# EasyEDA Pro project KeysDock65.eprj, schematic keyboard

## Sheets
1 keys: Board Name: keyboard; Create Date: 2025-10-11; Page Name: keys; Project Name: KeysDock65; Schematic Name: keyboard; Update Date: 2025-10-16; Company: 嘉立创EDA; Page Size: A4; Version: V1.0
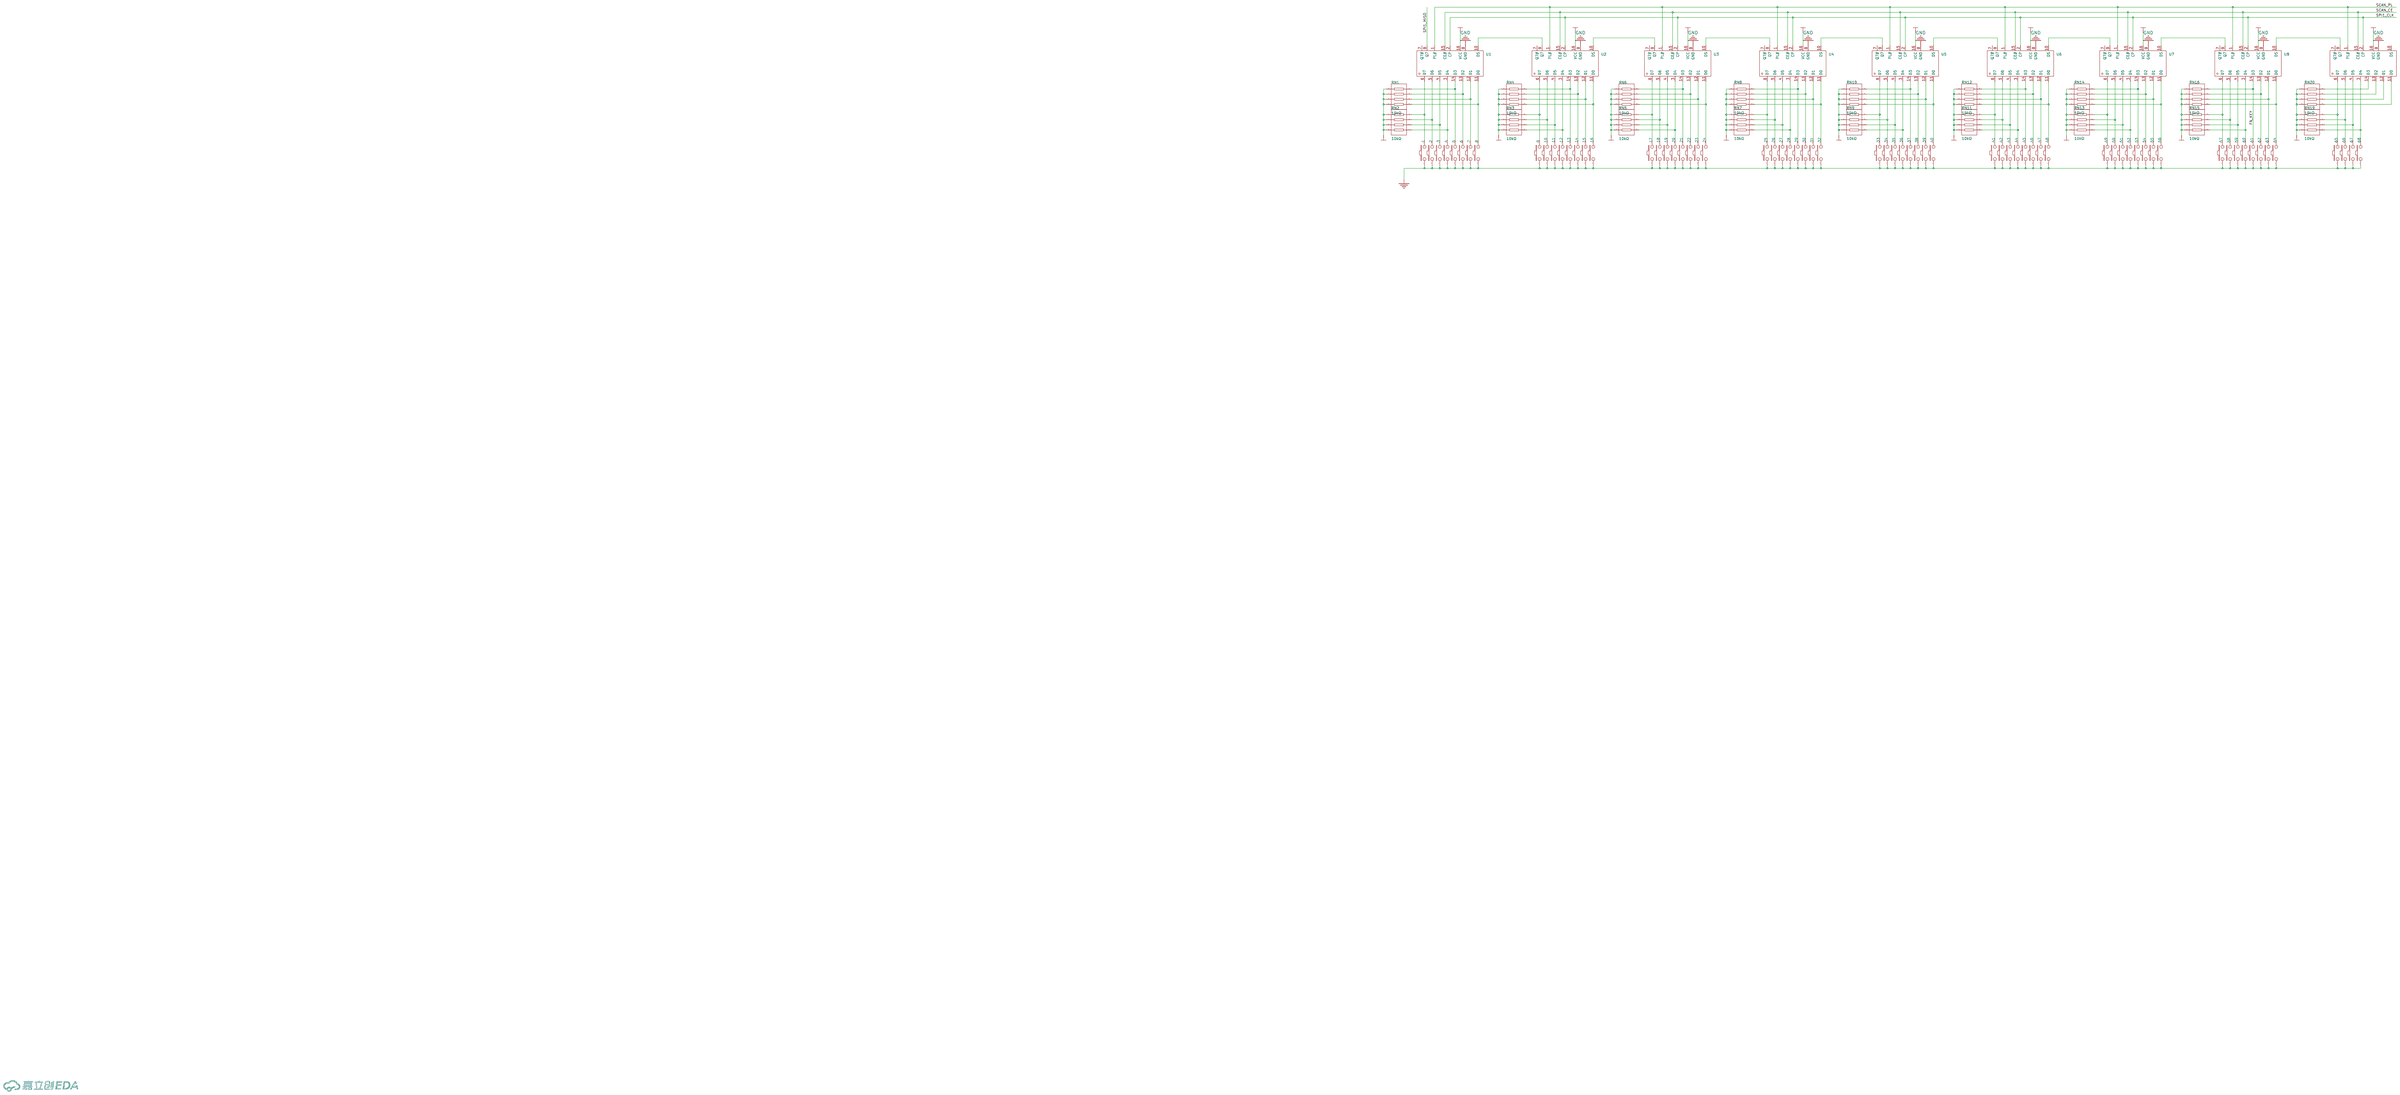
[diagram p0: keys]
2 mcu: Page Name: mcu
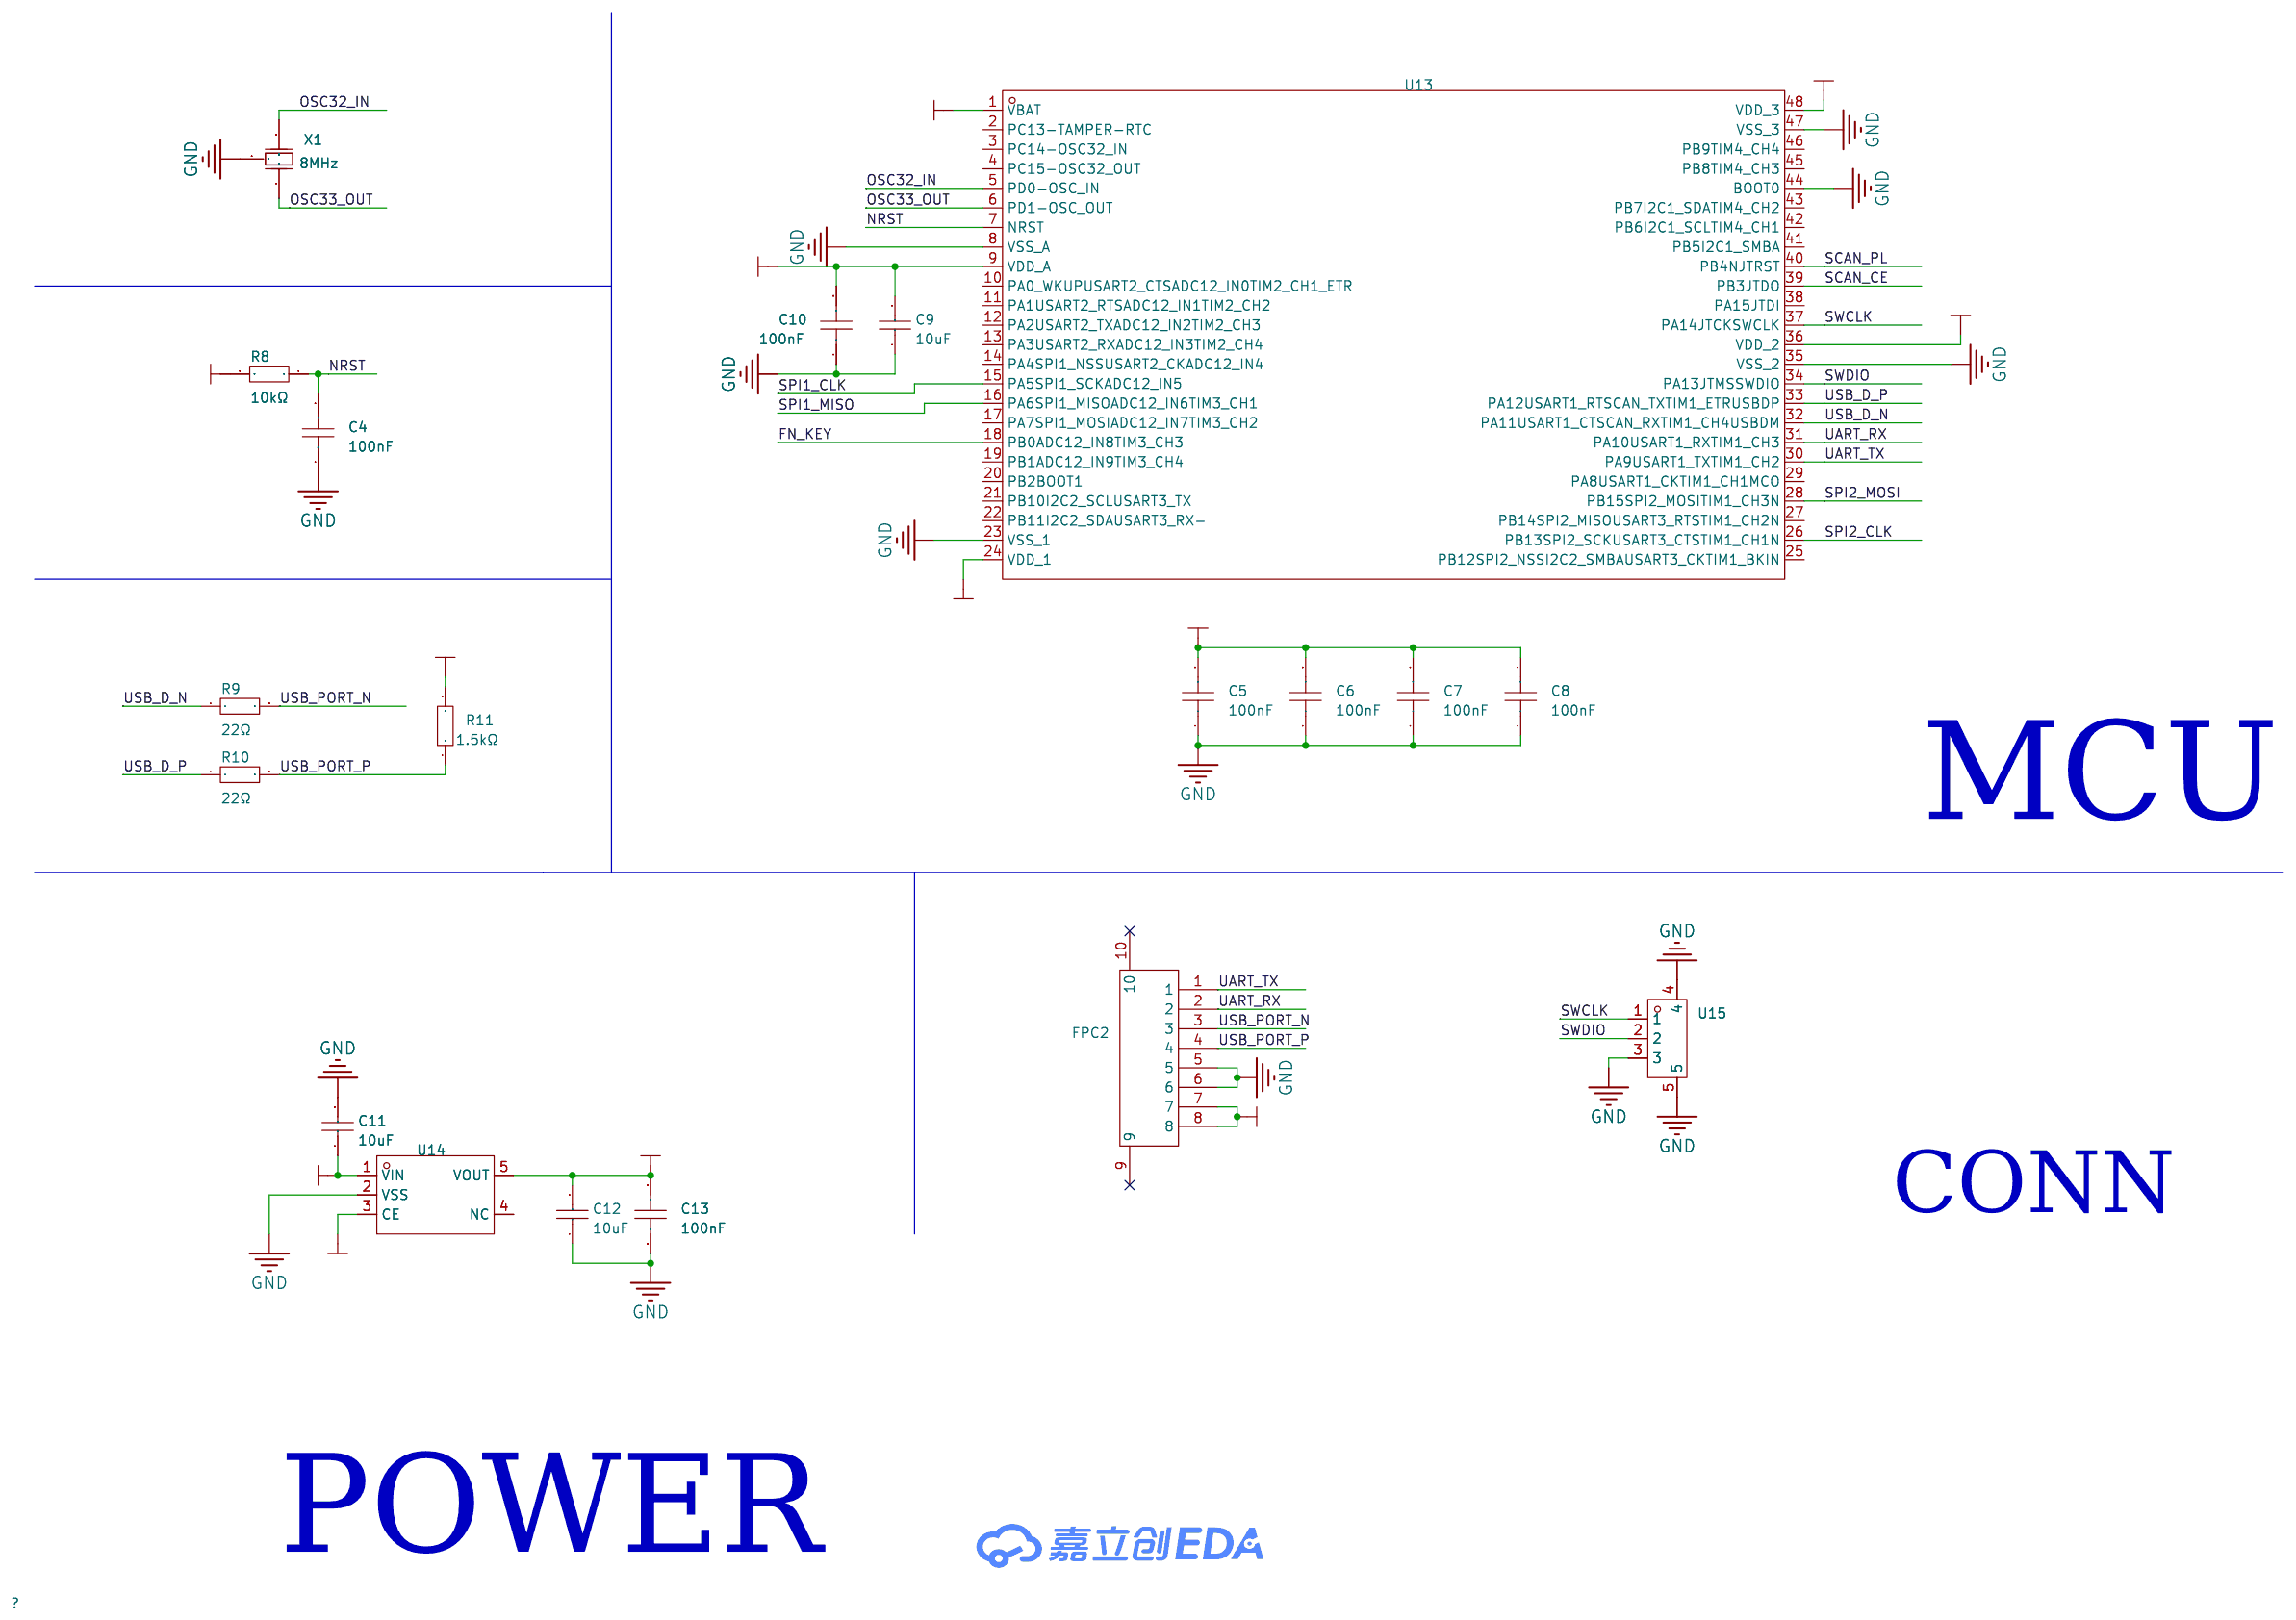
[diagram p1: mcu]
3 led: Page Name: led
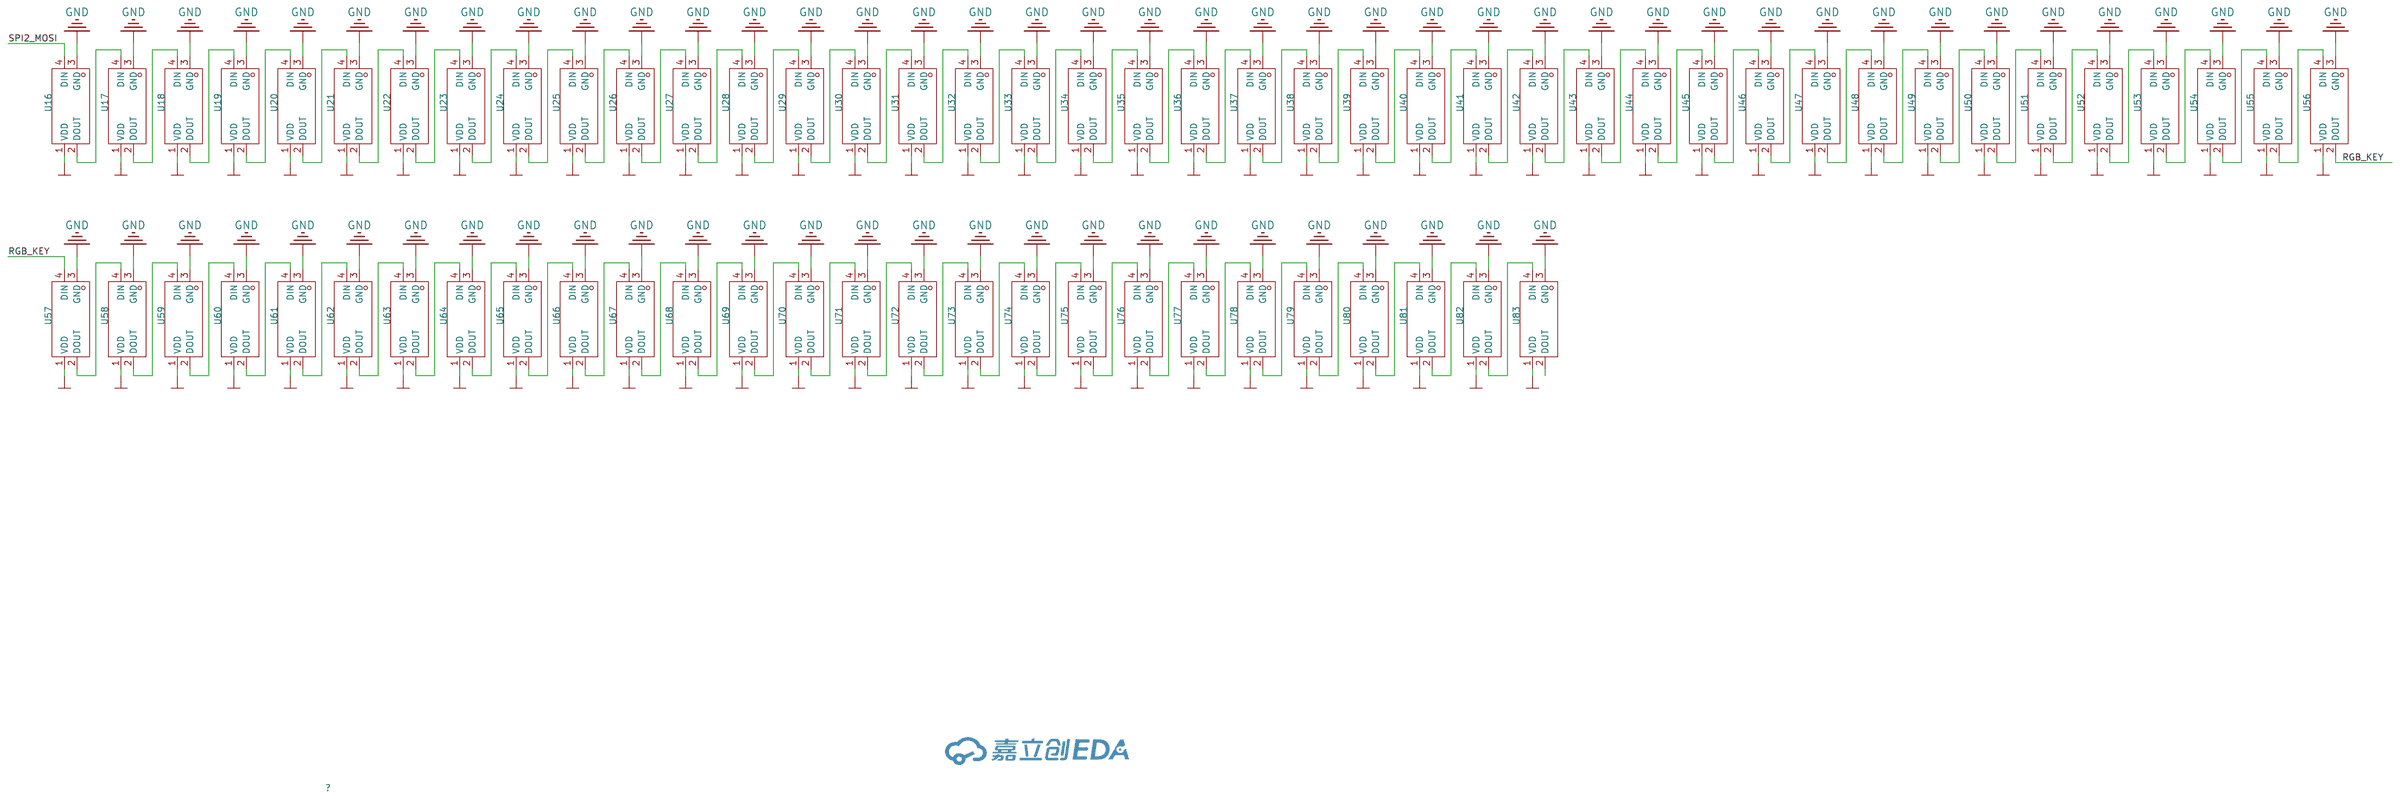
[diagram p2: led]

## Parts
sheet keys
1  -  [轴座_焊接热插拔_不带灯]
2  -  [轴座_焊接热插拔_不带灯]
3  -  [轴座_焊接热插拔_不带灯]
4  -  [轴座_焊接热插拔_不带灯]
5  -  [轴座_焊接热插拔_不带灯]
6  -  [轴座_焊接热插拔_不带灯]
7  -  [轴座_焊接热插拔_不带灯]
8  -  [轴座_焊接热插拔_不带灯]
9  -  [轴座_焊接热插拔_不带灯]
10  -  [轴座_焊接热插拔_不带灯]
11  -  [轴座_焊接热插拔_不带灯]
12  -  [轴座_焊接热插拔_不带灯]
13  -  [轴座_焊接热插拔_不带灯]
14  -  [轴座_焊接热插拔_不带灯]
15  -  [轴座_焊接热插拔_不带灯]
16  -  [轴座_焊接热插拔_不带灯]
17  -  [轴座_焊接热插拔_不带灯]
18  -  [轴座_焊接热插拔_不带灯]
19  -  [轴座_焊接热插拔_不带灯]
20  -  [轴座_焊接热插拔_不带灯]
21  -  [轴座_焊接热插拔_不带灯]
22  -  [轴座_焊接热插拔_不带灯]
23  -  [轴座_焊接热插拔_不带灯]
24  -  [轴座_焊接热插拔_不带灯]
25  -  [轴座_焊接热插拔_不带灯]
26  -  [轴座_焊接热插拔_不带灯]
27  -  [轴座_焊接热插拔_不带灯]
28  -  [轴座_焊接热插拔_不带灯]
29  -  [轴座_焊接热插拔_不带灯]
30  -  [轴座_焊接热插拔_不带灯]
31  -  [轴座_焊接热插拔_不带灯]
32  -  [轴座_焊接热插拔_不带灯]
33  -  [轴座_焊接热插拔_不带灯]
34  -  [轴座_焊接热插拔_不带灯]
35  -  [轴座_焊接热插拔_不带灯]
36  -  [轴座_焊接热插拔_不带灯]
37  -  [轴座_焊接热插拔_不带灯]
38  -  [轴座_焊接热插拔_不带灯]
39  -  [轴座_焊接热插拔_不带灯]
40  -  [轴座_焊接热插拔_不带灯]
41  -  [轴座_焊接热插拔_不带灯]
42  -  [轴座_焊接热插拔_不带灯]
43  -  [轴座_焊接热插拔_不带灯]
44  -  [轴座_焊接热插拔_不带灯]
45  -  [轴座_焊接热插拔_不带灯]
46  -  [轴座_焊接热插拔_不带灯]
47  -  [轴座_焊接热插拔_不带灯]
48  -  [轴座_焊接热插拔_不带灯]
49  -  [轴座_焊接热插拔_不带灯]
50  -  [轴座_焊接热插拔_不带灯]
51  -  [轴座_焊接热插拔_不带灯]
52  -  [轴座_焊接热插拔_不带灯]
53  -  [轴座_焊接热插拔_不带灯]
54  -  [轴座_焊接热插拔_不带灯]
55  -  [轴座_焊接热插拔_不带灯]
56  -  [轴座_焊接热插拔_不带灯]
57  -  [轴座_焊接热插拔_不带灯]
58  -  [轴座_焊接热插拔_不带灯]
59  -  [轴座_焊接热插拔_不带灯]
60  -  [轴座_焊接热插拔_不带灯]
61  -  [轴座_焊接热插拔_不带灯]
62  -  [轴座_焊接热插拔_不带灯]
63  -  [轴座_焊接热插拔_不带灯]
64  -  [轴座_焊接热插拔_不带灯]
65  -  [轴座_焊接热插拔_不带灯]
66  -  [轴座_焊接热插拔_不带灯]
67  -  [轴座_焊接热插拔_不带灯]
68  -  [轴座_焊接热插拔_不带灯]
RN1  10kΩ  [RES-ARRAY-SMD_0603-8P-L3.2-W1.6-BL]
RN2  10kΩ  [RES-ARRAY-SMD_0603-8P-L3.2-W1.6-BL]
RN3  10kΩ  [RES-ARRAY-SMD_0603-8P-L3.2-W1.6-BL]
RN4  10kΩ  [RES-ARRAY-SMD_0603-8P-L3.2-W1.6-BL]
RN5  10kΩ  [RES-ARRAY-SMD_0603-8P-L3.2-W1.6-BL]
RN6  10kΩ  [RES-ARRAY-SMD_0603-8P-L3.2-W1.6-BL]
RN7  10kΩ  [RES-ARRAY-SMD_0603-8P-L3.2-W1.6-BL]
RN8  10kΩ  [RES-ARRAY-SMD_0603-8P-L3.2-W1.6-BL]
RN9  10kΩ  [RES-ARRAY-SMD_0603-8P-L3.2-W1.6-BL]
RN10  10kΩ  [RES-ARRAY-SMD_0603-8P-L3.2-W1.6-BL]
RN11  10kΩ  [RES-ARRAY-SMD_0603-8P-L3.2-W1.6-BL]
RN12  10kΩ  [RES-ARRAY-SMD_0603-8P-L3.2-W1.6-BL]
RN13  10kΩ  [RES-ARRAY-SMD_0603-8P-L3.2-W1.6-BL]
RN14  10kΩ  [RES-ARRAY-SMD_0603-8P-L3.2-W1.6-BL]
RN15  10kΩ  [RES-ARRAY-SMD_0603-8P-L3.2-W1.6-BL]
RN16  10kΩ  [RES-ARRAY-SMD_0603-8P-L3.2-W1.6-BL]
RN19  10kΩ  [RES-ARRAY-SMD_0603-8P-L3.2-W1.6-BL]
RN20  10kΩ  [RES-ARRAY-SMD_0603-8P-L3.2-W1.6-BL]
U1  -  [SOIC-16_L9.9-W3.9-P1.27-LS6.0-BL]
U2  -  [SOIC-16_L9.9-W3.9-P1.27-LS6.0-BL]
U3  -  [SOIC-16_L9.9-W3.9-P1.27-LS6.0-BL]
U4  -  [SOIC-16_L9.9-W3.9-P1.27-LS6.0-BL]
U5  -  [SOIC-16_L9.9-W3.9-P1.27-LS6.0-BL]
U6  -  [SOIC-16_L9.9-W3.9-P1.27-LS6.0-BL]
U7  -  [SOIC-16_L9.9-W3.9-P1.27-LS6.0-BL]
U8  -  [SOIC-16_L9.9-W3.9-P1.27-LS6.0-BL]
U10  -  [SOIC-16_L9.9-W3.9-P1.27-LS6.0-BL]
sheet led
U16  XL-2020RGBC-2812B  [LED-SMD_4P-L2.0-W2.0-BR-1]
U17  XL-2020RGBC-2812B  [LED-SMD_4P-L2.0-W2.0-BR-1]
U18  XL-2020RGBC-2812B  [LED-SMD_4P-L2.0-W2.0-BR-1]
U19  XL-2020RGBC-2812B  [LED-SMD_4P-L2.0-W2.0-BR-1]
U20  XL-2020RGBC-2812B  [LED-SMD_4P-L2.0-W2.0-BR-1]
U21  XL-2020RGBC-2812B  [LED-SMD_4P-L2.0-W2.0-BR-1]
U22  XL-2020RGBC-2812B  [LED-SMD_4P-L2.0-W2.0-BR-1]
U23  XL-2020RGBC-2812B  [LED-SMD_4P-L2.0-W2.0-BR-1]
U24  XL-2020RGBC-2812B  [LED-SMD_4P-L2.0-W2.0-BR-1]
U25  XL-2020RGBC-2812B  [LED-SMD_4P-L2.0-W2.0-BR-1]
U26  XL-2020RGBC-2812B  [LED-SMD_4P-L2.0-W2.0-BR-1]
U27  XL-2020RGBC-2812B  [LED-SMD_4P-L2.0-W2.0-BR-1]
U28  XL-2020RGBC-2812B  [LED-SMD_4P-L2.0-W2.0-BR-1]
U29  XL-2020RGBC-2812B  [LED-SMD_4P-L2.0-W2.0-BR-1]
U30  XL-2020RGBC-2812B  [LED-SMD_4P-L2.0-W2.0-BR-1]
U31  XL-2020RGBC-2812B  [LED-SMD_4P-L2.0-W2.0-BR-1]
U32  XL-2020RGBC-2812B  [LED-SMD_4P-L2.0-W2.0-BR-1]
U33  XL-2020RGBC-2812B  [LED-SMD_4P-L2.0-W2.0-BR-1]
U34  XL-2020RGBC-2812B  [LED-SMD_4P-L2.0-W2.0-BR-1]
U35  XL-2020RGBC-2812B  [LED-SMD_4P-L2.0-W2.0-BR-1]
U36  XL-2020RGBC-2812B  [LED-SMD_4P-L2.0-W2.0-BR-1]
U37  XL-2020RGBC-2812B  [LED-SMD_4P-L2.0-W2.0-BR-1]
U38  XL-2020RGBC-2812B  [LED-SMD_4P-L2.0-W2.0-BR-1]
U39  XL-2020RGBC-2812B  [LED-SMD_4P-L2.0-W2.0-BR-1]
U40  XL-2020RGBC-2812B  [LED-SMD_4P-L2.0-W2.0-BR-1]
U41  XL-2020RGBC-2812B  [LED-SMD_4P-L2.0-W2.0-BR-1]
U42  XL-2020RGBC-2812B  [LED-SMD_4P-L2.0-W2.0-BR-1]
U43  XL-2020RGBC-2812B  [LED-SMD_4P-L2.0-W2.0-BR-1]
U44  XL-2020RGBC-2812B  [LED-SMD_4P-L2.0-W2.0-BR-1]
U45  XL-2020RGBC-2812B  [LED-SMD_4P-L2.0-W2.0-BR-1]
U46  XL-2020RGBC-2812B  [LED-SMD_4P-L2.0-W2.0-BR-1]
U47  XL-2020RGBC-2812B  [LED-SMD_4P-L2.0-W2.0-BR-1]
U48  XL-2020RGBC-2812B  [LED-SMD_4P-L2.0-W2.0-BR-1]
U49  XL-2020RGBC-2812B  [LED-SMD_4P-L2.0-W2.0-BR-1]
U50  XL-2020RGBC-2812B  [LED-SMD_4P-L2.0-W2.0-BR-1]
U51  XL-2020RGBC-2812B  [LED-SMD_4P-L2.0-W2.0-BR-1]
U52  XL-2020RGBC-2812B  [LED-SMD_4P-L2.0-W2.0-BR-1]
U53  XL-2020RGBC-2812B  [LED-SMD_4P-L2.0-W2.0-BR-1]
U54  XL-2020RGBC-2812B  [LED-SMD_4P-L2.0-W2.0-BR-1]
U55  XL-2020RGBC-2812B  [LED-SMD_4P-L2.0-W2.0-BR-1]
U56  XL-2020RGBC-2812B  [LED-SMD_4P-L2.0-W2.0-BR-1]
U57  XL-2020RGBC-2812B  [LED-SMD_4P-L2.0-W2.0-BR-1]
U58  XL-2020RGBC-2812B  [LED-SMD_4P-L2.0-W2.0-BR-1]
U59  XL-2020RGBC-2812B  [LED-SMD_4P-L2.0-W2.0-BR-1]
U60  XL-2020RGBC-2812B  [LED-SMD_4P-L2.0-W2.0-BR-1]
U61  XL-2020RGBC-2812B  [LED-SMD_4P-L2.0-W2.0-BR-1]
U62  XL-2020RGBC-2812B  [LED-SMD_4P-L2.0-W2.0-BR-1]
U63  XL-2020RGBC-2812B  [LED-SMD_4P-L2.0-W2.0-BR-1]
U64  XL-2020RGBC-2812B  [LED-SMD_4P-L2.0-W2.0-BR-1]
U65  XL-2020RGBC-2812B  [LED-SMD_4P-L2.0-W2.0-BR-1]
U66  XL-2020RGBC-2812B  [LED-SMD_4P-L2.0-W2.0-BR-1]
U67  XL-2020RGBC-2812B  [LED-SMD_4P-L2.0-W2.0-BR-1]
U68  XL-2020RGBC-2812B  [LED-SMD_4P-L2.0-W2.0-BR-1]
U69  XL-2020RGBC-2812B  [LED-SMD_4P-L2.0-W2.0-BR-1]
U70  XL-2020RGBC-2812B  [LED-SMD_4P-L2.0-W2.0-BR-1]
U71  XL-2020RGBC-2812B  [LED-SMD_4P-L2.0-W2.0-BR-1]
U72  XL-2020RGBC-2812B  [LED-SMD_4P-L2.0-W2.0-BR-1]
U73  XL-2020RGBC-2812B  [LED-SMD_4P-L2.0-W2.0-BR-1]
U74  XL-2020RGBC-2812B  [LED-SMD_4P-L2.0-W2.0-BR-1]
U75  XL-2020RGBC-2812B  [LED-SMD_4P-L2.0-W2.0-BR-1]
U76  XL-2020RGBC-2812B  [LED-SMD_4P-L2.0-W2.0-BR-1]
U77  XL-2020RGBC-2812B  [LED-SMD_4P-L2.0-W2.0-BR-1]
U78  XL-2020RGBC-2812B  [LED-SMD_4P-L2.0-W2.0-BR-1]
U79  XL-2020RGBC-2812B  [LED-SMD_4P-L2.0-W2.0-BR-1]
U80  XL-2020RGBC-2812B  [LED-SMD_4P-L2.0-W2.0-BR-1]
U81  XL-2020RGBC-2812B  [LED-SMD_4P-L2.0-W2.0-BR-1]
U82  XL-2020RGBC-2812B  [LED-SMD_4P-L2.0-W2.0-BR-1]
U83  XL-2020RGBC-2812B  [LED-SMD_4P-L2.0-W2.0-BR-1]
sheet mcu
C4  100nF  [C0402]
C5  100nF  [C0402]
C6  100nF  [C0402]
C7  100nF  [C0402]
C8  100nF  [C0402]
C9  10uF  [C0402]
C10  100nF  [C0402]
C11  10uF  [C0402]
C12  10uF  [C0402]
C13  100nF  [C0402]
FPC2  -  [FPC-SMD_P0.50-8P_FGS-XJ-H2.0]
R8  10kΩ  [R0402]
R9  22Ω  [R0402]
R10  22Ω  [R0402]
R11  1.5kΩ  [R0402]
U13  -  [LQFP-48_L7.0-W7.0-P0.50-LS9.0-BL]
U14  -  [SOT-25_L3.0-W1.6-P0.95-LS2.8-BL_1]
U15  ZX-SH1.0-3PWT  [CONN-SMD_3P-P1.00_MEGASTAR_ZX-SH1.0-3PWT]
X1  8MHz  [OSC-SMD_3P-L3.2-W1.3-P1.20-L]

## Library data of the parts
1-68 = KEYBOARD-SW: Origin Footprint 2: MX-KEY
RN1-RN16 RN19 RN20 = 4D03WGJ0103T5E: 阻值:10kΩ;精度:±5%;单个元件功率:62.5mW;温度系数:±200ppm/;电阻器数:4;引脚数:8;; LCSC Part Name: 10kΩ ±5%; Supplier Part: C29718; Manufacturer: UNI-ROYAL(厚声); Supplier Footprint: 0603x4; Datasheet: https://atta.szlcsc.com/upload/public/pdf/source/20170615/1497511005633.pdf; Supplier: LCSC; Tolerance: ±5%; Power(Watts): 62.5mW; Temperature Coefficient: ±200ppm/; Number of Resistors: 4; Number of Pins: 8
U1-U8 U10 = 74HC165D,653: Supplier Part: C5613; Manufacturer: Nexperia(安世); Supplier Footprint: SOIC-16_150mil; Datasheet: https://atta.szlcsc.com/upload/public/pdf/source/20160218/1457707760975.pdf; Supplier: LCSC
U16-U83 = XL-2020RGBC-2812B: LCSC Part Name: 幻彩透明 XL-2020RGBC-WS2812B; Supplier Part: C5349955; Manufacturer: XINGLIGHT(成兴光); Supplier Footprint: 2020; JLCPCB Part Class: Extended Part; Datasheet: https://item.szlcsc.com/datasheet/XL-2020RGBC-2812B/6136404.html; Supplier: LCSC; Wavelength: 620nm~625nm；470nm~475nm；525nm~530nm; Luminous Intensity: 150mcd；150mcd；400mcd; Fixed-Frequency Pwm Mode: 1.5kHz; Data Transmission Rate: 800Kbit/s; Voltage - Supply: 3.5V~5.5V; Quiescent Current: 0.5mA; Lens Color: 半透明雾状透镜; ESD Withstand Voltage: 2000V; Installation method: 正贴; Operating Temperature: -20℃~+85℃; Peak Wavelength: R:625nm；B:470nm；G:525nm; Viewing Angle: 120°; Length: 2mm; Width: 0.65mm; Height: 2mm
C4-C8 C10 C13 = CL05B104KB54PNC: 容值:100nF;精度:±10%;额定电压:50V;温度系数:X7R;; LCSC Part Name: 100nF ±10% 50V; Supplier Part: C307331; Manufacturer: SAMSUNG(三星); Supplier Footprint: 0402; Datasheet: https://atta.szlcsc.com/upload/public/pdf/source/20181009/C307331_222F7C870FD3EA5F46F538B483443886.pdf; Supplier: LCSC; Tolerance: ±10%; Voltage Rated: 50V; Temperature Coefficient: X7R
C9 C11 C12 = CL05A106MQ5NUNC: 容值:10uF;精度:±20%;额定电压:6.3V;温度系数:X5R;; LCSC Part Name: 10uF ±20% 6.3V; Supplier Part: C15525; Manufacturer: SAMSUNG(三星); Supplier Footprint: 0402; Datasheet: https://atta.szlcsc.com/upload/public/pdf/source/20160103/1457707676445.pdf; Supplier: LCSC; Tolerance: ±20%; Voltage Rated: 6.3V; Temperature Coefficient: X5R
FPC2 = AFC01-S08FCA-00: 间距:0.5mm;触点数量:8;锁定特性:翻盖式;安装类型:卧贴;触点类型:下接;; LCSC Part Name: 0.5mm P数:8 翻盖式 下接; Supplier Part: C262657; Manufacturer: JS(钜硕电子); Supplier Footprint: SMD,P=0.5mm; Datasheet: https://atta.szlcsc.com/upload/public/pdf/source/20180814/C262657_E4DDBFDEF95394073062C4B6399AAD54.pdf; Supplier: LCSC; Pitch: 0.5mm; Number of Contacts: 8; Locking Feature: 翻盖式; Mounting Type: 卧贴; Contact Type: 下接; Height Above Board: 2mm; FFC, FCB Thickness: 0.3mm
R8 = 0402WGF1002TCE: 电阻类型:厚膜电阻;阻值:10kΩ;精度:±1%;功率:62.5mW;温度系数:±100ppm/;最大工作电压:50V;工作温度范围:-55~+155;; LCSC Part Name: 10kΩ ±1% 62.5mW; Supplier Part: C25744; Manufacturer: UNI-ROYAL(厚声); Supplier Footprint: 0402; Datasheet: https://atta.szlcsc.com/upload/public/pdf/source/20200306/C422600_1E6D84923E4A46A82E41ADD87F860B5C.pdf; Supplier: LCSC; Type: 厚膜电阻; Tolerance: ±1%; Power(Watts): 62.5mW; Temperature Coefficient: ±100ppm/; Overload Voltage (Max): 50V; Operating Temperature Range: -55~+155
R9 R10 = 0402WGF220JTCE: 电阻类型:厚膜电阻;阻值:22Ω;精度:±1%;功率:62.5mW;温度系数:±200ppm/;最大工作电压:50V;工作温度范围:-55~+155;; LCSC Part Name: 22Ω ±1% 62.5mW; Supplier Part: C25092; Manufacturer: UNI-ROYAL(厚声); Supplier Footprint: 0402; Datasheet: https://atta.szlcsc.com/upload/public/pdf/source/20200306/C422600_1E6D84923E4A46A82E41ADD87F860B5C.pdf; Supplier: LCSC; Type: 厚膜电阻; Tolerance: ±1%; Power(Watts): 62.5mW; Temperature Coefficient: ±200ppm/; Overload Voltage (Max): 50V; Operating Temperature Range: -55~+155
R11 = 0402WGF1501TCE: 阻值:1.5kΩ;精度:±1%;功率:1/16W;温度系数:±100ppm/;最大工作电压:50V;工作温度范围:-55~+155;; LCSC Part Name: 1.5KΩ ±1%; Supplier Part: C25867; Manufacturer: UNI-ROYAL(厚声); Supplier Footprint: 0402; Datasheet: https://atta.szlcsc.com/upload/public/pdf/source/20170920/C25867_1505895090394980874.pdf; Supplier: LCSC; Tolerance: ±1%; Power(Watts): 1/16W; Temperature Coefficient: ±100ppm/; Overload Voltage (Max): 50V; Operating Temperature Range: -55~+155
U13 = STM32F103CBT6: 主频（MAX):72MHz;工作电压:2V ~ 3.6V;; Supplier Part: C8304; Manufacturer: ST(意法半导体); Supplier Footprint: LQFP-48_7x7x05P; Datasheet: https://atta.szlcsc.com/upload/public/pdf/source/20140724/1457707170379.pdf; Supplier: LCSC; Speed: 72MHz; Voltage - Supply (Vcc/Vdd): 2V ~ 3.6V; RAM Size: 20KB; Number of I/O: 37; A/D: 16x12bit; PWM: 13; UART/USART: 3 USART; I2C（SMBUS/PMBUS）: 2; USB Device: 1; CAN: 1
U14 = XC6210B332MR_6: 输出类型:固定;输出极性:正;输出通道数:1;最大输入电压:6V;输出电压:3.3V;压差:75mV@(100mA);输出电流:900mA;电源纹波抑制比(PRSS):60dB@(1kHz);; LCSC Part Name: Vin=6V Vout=3.3V 900mA 60dB@(1kHz); Supplier Part: C424705; Manufacturer: TOREX(特瑞仕); Manufacturer Part: XC6210B332MR; Supplier Footprint: SOT-25; Datasheet: https://atta.szlcsc.com/upload/public/pdf/source/20190903/C424705_1DFB2113A9A78D399905DBF688657204.pdf; Supplier: LCSC; Output Type: 固定; Output Polarity: 正; Number of Outputs: 1; Maximum Input Voltage: 6V; Output Voltage: 3.3V; Dropout Voltage: 75mV@(100mA); Output Current: 900mA; Power Supply Rejection Ratio (PRSS): 60dB@(1kHz)
U15 = ZX-SH1.0-3PWT: LCSC Part Name: 1x3P 间距:1mm 卧贴 系列:SH; Supplier Part: C7430445; Manufacturer: Megastar(兆星); Supplier Footprint: SMD,P=1mm,卧贴; JLCPCB Part Class: Extended Part; Datasheet: https://item.szlcsc.com/datasheet/ZX-SH1.0-3PWT/8430314.html; Supplier: LCSC; Pins Structure: 1x3P; Pitch: 1mm; Mounting Type: 卧贴; Reference Series: SH; Number of Pins: 3P; Number of Rows: 1; Number of PINs Per Row: 3; Current Rating: 1A; Contact Material: 黄铜; Contact Plating: 锡; Voltage Rating: 50V; Plastic Material: LCP; Supplementary Features: 辅助焊脚; Color: 米色; Z-Height of the Board: 3.15mm; X-Length of Bottom Edge on Board (Spacing Line): 5.35mm; Y-Width of Bottom Edge on Board: 5.05mm
X1 = CSTNE8M00GH5C000R0: 频率:8MHz;频率容差:±0.07%;内藏负载电容:33pF;谐振阻抗:40Ω;; LCSC Part Name: 8MHz ±0.07% 33pF; Supplier Part: C341525; Manufacturer: muRata(村田); Supplier Footprint: SMD3213-3P; Datasheet: https://atta.szlcsc.com/upload/public/pdf/source/20181211/C341525_832BA077079E4863A5153C1DB98581D5.pdf; Supplier: LCSC; Frequency Stability: ±0.13%; Frequency Tolerance: ±0.07%; Built-in Load Capacitance: 33pF; Resonant Impedance: 40Ω; Operating Temperature: -40~+125

## Nets
GND: 1.1 2.1 3.1 4.1 5.1 6.1 7.1 8.1 9.1 10.1 11.1 12.1 13.1 14.1 15.1 16.1 17.1 18.1 19.1 20.1 21.1 22.1 23.1 24.1 25.1 26.1 27.1 28.1 29.1 30.1 31.1 32.1 33.1 34.1 35.1 36.1 37.1 38.1 39.1 40.1 41.1 42.1 43.1 44.1 45.1 46.1 47.1 48.1 49.1 50.1 51.1 52.1 53.1 54.1 55.1 56.1 57.1 58.1 59.1 60.1 61.1 62.1 63.1 64.1 65.1 66.1 67.1 68.1 C4.1 C5.1 C6.1 C7.1 C8.1 C9.1 C10.1 C11.2 C12.1 C13.1 FPC2.5 FPC2.6 U1.8(GND) U2.8(GND) U3.8(GND) U4.8(GND) U5.8(GND) U6.8(GND) U7.8(GND) U8.8(GND) U10.8(GND) U13.8(VSS_A) U13.23(VSS_1) U13.35(VSS_2) U13.44(BOOT0) U13.47(VSS_3) U14.2(VSS) U15.3 U15.4 U15.5 U16.3(GND) U17.3(GND) U18.3(GND) U19.3(GND) U20.3(GND) U21.3(GND) U22.3(GND) U23.3(GND) U24.3(GND) U25.3(GND) U26.3(GND) U27.3(GND) U28.3(GND) U29.3(GND) U30.3(GND) U31.3(GND) U32.3(GND) U33.3(GND) U34.3(GND) U35.3(GND) U36.3(GND) U37.3(GND) U38.3(GND) U39.3(GND) U40.3(GND) U41.3(GND) U42.3(GND) U43.3(GND) U44.3(GND) U45.3(GND) U46.3(GND) U47.3(GND) U48.3(GND) U49.3(GND) U50.3(GND) U51.3(GND) U52.3(GND) U53.3(GND) U54.3(GND) U55.3(GND) U56.3(GND) U57.3(GND) U58.3(GND) U59.3(GND) U60.3(GND) U61.3(GND) U62.3(GND) U63.3(GND) U64.3(GND) U65.3(GND) U66.3(GND) U67.3(GND) U68.3(GND) U69.3(GND) U70.3(GND) U71.3(GND) U72.3(GND) U73.3(GND) U74.3(GND) U75.3(GND) U76.3(GND) U77.3(GND) U78.3(GND) U79.3(GND) U80.3(GND) U81.3(GND) U82.3(GND) U83.3(GND) X1.2(GND)
VCC_3V3: C5.2 C6.2 C7.2 C8.2 C9.2 C10.2 C12.2 C13.2 R8.2 R11.2 RN1.5 RN1.6 RN1.7 RN1.8 RN2.5 RN2.6 RN2.7 RN2.8 RN3.1 RN3.2 RN3.3 RN3.4 RN4.1 RN4.2 RN4.3 RN4.4 RN5.1 RN5.2 RN5.3 RN5.4 RN6.1 RN6.2 RN6.3 RN6.4 RN7.1 RN7.2 RN7.3 RN7.4 RN8.1 RN8.2 RN8.3 RN8.4 RN9.1 RN9.2 RN9.3 RN9.4 RN10.1 RN10.2 RN10.3 RN10.4 RN11.1 RN11.2 RN11.3 RN11.4 RN12.1 RN12.2 RN12.3 RN12.4 RN13.1 RN13.2 RN13.3 RN13.4 RN14.1 RN14.2 RN14.3 RN14.4 RN15.1 RN15.2 RN15.3 RN15.4 RN16.1 RN16.2 RN16.3 RN16.4 RN19.1 RN19.2 RN19.3 RN19.4 RN20.1 RN20.2 RN20.3 RN20.4 U1.16(VCC) U2.16(VCC) U3.16(VCC) U4.16(VCC) U5.16(VCC) U6.16(VCC) U7.16(VCC) U8.16(VCC) U10.16(VCC) U13.1(VBAT) U13.9(VDD_A) U13.24(VDD_1) U13.36(VDD_2) U13.48(VDD_3) U14.5(VOUT)
VCC_5V: C11.1 FPC2.7 FPC2.8 U14.1(VIN) U14.3(CE) U16.1(VDD) U17.1(VDD) U18.1(VDD) U19.1(VDD) U20.1(VDD) U21.1(VDD) U22.1(VDD) U23.1(VDD) U24.1(VDD) U25.1(VDD) U26.1(VDD) U27.1(VDD) U28.1(VDD) U29.1(VDD) U30.1(VDD) U31.1(VDD) U32.1(VDD) U33.1(VDD) U34.1(VDD) U35.1(VDD) U36.1(VDD) U37.1(VDD) U38.1(VDD) U39.1(VDD) U40.1(VDD) U41.1(VDD) U42.1(VDD) U43.1(VDD) U44.1(VDD) U45.1(VDD) U46.1(VDD) U47.1(VDD) U48.1(VDD) U49.1(VDD) U50.1(VDD) U51.1(VDD) U52.1(VDD) U53.1(VDD) U54.1(VDD) U55.1(VDD) U56.1(VDD) U57.1(VDD) U58.1(VDD) U59.1(VDD) U60.1(VDD) U61.1(VDD) U62.1(VDD) U63.1(VDD) U64.1(VDD) U65.1(VDD) U66.1(VDD) U67.1(VDD) U68.1(VDD) U69.1(VDD) U70.1(VDD) U71.1(VDD) U72.1(VDD) U73.1(VDD) U74.1(VDD) U75.1(VDD) U76.1(VDD) U77.1(VDD) U78.1(VDD) U79.1(VDD) U80.1(VDD) U81.1(VDD) U82.1(VDD) U83.1(VDD)
FN_KEY: 61.2 RN16.5 U8.14(D3) U13.18(PB0ADC12_IN8TIM3_CH3)
NRST: C4.2 R8.1 U13.7(NRST)
OSC32_IN: U13.5(PD0-OSC_IN) X1.3(OSC2)
OSC33_OUT: U13.6(PD1-OSC_OUT) X1.1(OSC1)
RGB_KEY: U56.2(DOUT) U57.4(DIN)
SCAN_CE: U1.15(CE#) U2.15(CE#) U3.15(CE#) U4.15(CE#) U5.15(CE#) U6.15(CE#) U7.15(CE#) U8.15(CE#) U10.15(CE#) U13.39(PB3JTDO)
SCAN_PL: U1.1(PL#) U2.1(PL#) U3.1(PL#) U4.1(PL#) U5.1(PL#) U6.1(PL#) U7.1(PL#) U8.1(PL#) U10.1(PL#) U13.40(PB4NJTRST)
SPI1_CLK: U1.2(CP) U2.2(CP) U3.2(CP) U4.2(CP) U5.2(CP) U6.2(CP) U7.2(CP) U8.2(CP) U10.2(CP) U13.15(PA5SPI1_SCKADC12_IN5)
SPI1_MISO: U1.9(Q7) U13.16(PA6SPI1_MISOADC12_IN6TIM3_CH1)
SPI2_CLK: U13.26(PB13SPI2_SCKUSART3_CTSTIM1_CH1N)
SPI2_MOSI: U13.28(PB15SPI2_MOSITIM1_CH3N) U16.4(DIN)
SWCLK: U13.37(PA14JTCKSWCLK) U15.1
SWDIO: U13.34(PA13JTMSSWDIO) U15.2
UART_RX: FPC2.2 U13.31(PA10USART1_RXTIM1_CH3)
UART_TX: FPC2.1 U13.30(PA9USART1_TXTIM1_CH2)
USB_D_N: R9.1 U13.32(PA11USART1_CTSCAN_RXTIM1_CH4USBDM)
USB_D_P: R10.1 U13.33(PA12USART1_RTSCAN_TXTIM1_ETRUSBDP)
USB_PORT_N: FPC2.3 R9.2
USB_PORT_P: FPC2.4 R10.2 R11.1
$1N4467: 1.2 RN2.1 U1.6(D7)
$1N4468: 2.2 RN2.2 U1.5(D6)
$1N4469: 3.2 RN2.3 U1.4(D5)
$1N4471: 4.2 RN2.4 U1.3(D4)
$1N4472: 8.2 RN1.4 U1.11(D0)
$1N4473: 5.2 RN1.1 U1.14(D3)
$1N4474: 6.2 RN1.2 U1.13(D2)
$1N4475: 7.2 RN1.3 U1.12(D1)
$1N4481: 25.2 RN7.5 U4.6(D7)
$1N4482: 26.2 RN7.6 U4.5(D6)
$1N4483: 27.2 RN7.7 U4.4(D5)
$1N4484: 28.2 RN7.8 U4.3(D4)
$1N4485: 32.2 RN8.8 U4.11(D0)
$1N4486: 29.2 RN8.5 U4.14(D3)
$1N4487: 30.2 RN8.6 U4.13(D2)
$1N4488: 31.2 RN8.7 U4.12(D1)
$1N4493: 49.2 RN13.5 U7.6(D7)
$1N4494: 50.2 RN13.6 U7.5(D6)
$1N4495: 51.2 RN13.7 U7.4(D5)
$1N4496: 52.2 RN13.8 U7.3(D4)
$1N4497: 56.2 RN14.8 U7.11(D0)
$1N4498: 53.2 RN14.5 U7.14(D3)
$1N4499: 54.2 RN14.6 U7.13(D2)
$1N4500: 55.2 RN14.7 U7.12(D1)
$1N4504: 57.2 RN15.5 U8.6(D7)
$1N4505: 58.2 RN15.6 U8.5(D6)
$1N4506: 59.2 RN15.7 U8.4(D5)
$1N4507: 60.2 RN15.8 U8.3(D4)
$1N4508: 64.2 RN16.8 U8.11(D0)
$1N4510: 62.2 RN16.6 U8.13(D2)
$1N4511: 63.2 RN16.7 U8.12(D1)
$1N4526: 65.2 RN19.5 U10.6(D7)
$1N4527: 66.2 RN19.6 U10.5(D6)
$1N4534: 15.2 RN4.7 U2.12(D1)
$1N4535: 14.2 RN4.6 U2.13(D2)
$1N4536: 13.2 RN4.5 U2.14(D3)
$1N4537: 16.2 RN4.8 U2.11(D0)
$1N4538: 12.2 RN3.8 U2.3(D4)
$1N4539: 11.2 RN3.7 U2.4(D5)
$1N4540: 10.2 RN3.6 U2.5(D6)
$1N4541: 9.2 RN3.5 U2.6(D7)
$1N4545: 47.2 RN12.7 U6.12(D1)
$1N4546: 46.2 RN12.6 U6.13(D2)
$1N4547: 45.2 RN12.5 U6.14(D3)
$1N4548: 48.2 RN12.8 U6.11(D0)
$1N4549: 44.2 RN11.8 U6.3(D4)
$1N4550: 43.2 RN11.7 U6.4(D5)
$1N4551: 42.2 RN11.6 U6.5(D6)
$1N4552: 41.2 RN11.5 U6.6(D7)
$1N4555: 38.2 RN10.6 U5.13(D2)
$1N4556: 40.2 RN10.8 U5.11(D0)
$1N4557: 36.2 RN9.8 U5.3(D4)
$1N4558: 34.2 RN9.6 U5.5(D6)
$1N4559: 37.2 RN10.5 U5.14(D3)
$1N4560: 39.2 RN10.7 U5.12(D1)
$1N4561: 35.2 RN9.7 U5.4(D5)
$1N4562: 33.2 RN9.5 U5.6(D7)
$1N4563: U1.10(DS) U2.9(Q7)
$1N4564: U2.10(DS) U3.9(Q7)
$1N4565: U3.10(DS) U4.9(Q7)
$1N4566: U4.10(DS) U5.9(Q7)
$1N4567: U5.10(DS) U6.9(Q7)
$1N4568: U6.10(DS) U7.9(Q7)
$1N4569: U7.10(DS) U8.9(Q7)
$1N4571: U8.10(DS) U10.9(Q7)
$1N4590: RN20.8 U10.11(D0)
$1N4591: RN20.7 U10.12(D1)
$1N4592: RN20.6 U10.13(D2)
$1N4593: RN20.5 U10.14(D3)
$1N4614: 20.2 RN5.8 U3.3(D4)
$1N4615: 19.2 RN5.7 U3.4(D5)
$1N4616: 18.2 RN5.6 U3.5(D6)
$1N4617: 17.2 RN5.5 U3.6(D7)
$1N4618: 23.2 RN6.7 U3.12(D1)
$1N4619: 22.2 RN6.6 U3.13(D2)
$1N4620: 21.2 RN6.5 U3.14(D3)
$1N4621: 24.2 RN6.8 U3.11(D0)
$1N10681: 68.2 RN19.8 U10.3(D4)
$1N10690: 67.2 RN19.7 U10.4(D5)
$3N6224: U16.2(DOUT) U17.4(DIN)
$3N6227: U17.2(DOUT) U18.4(DIN)
$3N6231: U18.2(DOUT) U19.4(DIN)
$3N6233: U19.2(DOUT) U20.4(DIN)
$3N6237: U20.2(DOUT) U21.4(DIN)
$3N6239: U21.2(DOUT) U22.4(DIN)
$3N6243: U22.2(DOUT) U23.4(DIN)
$3N6245: U23.2(DOUT) U24.4(DIN)
$3N6249: U24.2(DOUT) U25.4(DIN)
$3N6251: U25.2(DOUT) U26.4(DIN)
$3N6255: U26.2(DOUT) U27.4(DIN)
$3N6257: U27.2(DOUT) U28.4(DIN)
$3N6261: U28.2(DOUT) U29.4(DIN)
$3N6263: U29.2(DOUT) U30.4(DIN)
$3N6267: U30.2(DOUT) U31.4(DIN)
$3N6269: U31.2(DOUT) U32.4(DIN)
$3N6273: U32.2(DOUT) U33.4(DIN)
$3N6275: U33.2(DOUT) U34.4(DIN)
$3N6279: U34.2(DOUT) U35.4(DIN)
$3N6281: U35.2(DOUT) U36.4(DIN)
$3N6285: U36.2(DOUT) U37.4(DIN)
$3N6287: U37.2(DOUT) U38.4(DIN)
$3N6291: U38.2(DOUT) U39.4(DIN)
$3N6293: U39.2(DOUT) U40.4(DIN)
$3N6297: U40.2(DOUT) U41.4(DIN)
$3N6299: U41.2(DOUT) U42.4(DIN)
$3N6303: U42.2(DOUT) U43.4(DIN)
$3N6305: U43.2(DOUT) U44.4(DIN)
$3N6309: U44.2(DOUT) U45.4(DIN)
$3N6311: U45.2(DOUT) U46.4(DIN)
$3N6315: U46.2(DOUT) U47.4(DIN)
$3N6317: U47.2(DOUT) U48.4(DIN)
$3N6321: U48.2(DOUT) U49.4(DIN)
$3N6323: U49.2(DOUT) U50.4(DIN)
$3N6327: U50.2(DOUT) U51.4(DIN)
$3N6329: U51.2(DOUT) U52.4(DIN)
$3N6333: U52.2(DOUT) U53.4(DIN)
$3N6335: U53.2(DOUT) U54.4(DIN)
$3N6339: U54.2(DOUT) U55.4(DIN)
$3N6344: U55.2(DOUT) U56.4(DIN)
$3N6350: U57.2(DOUT) U58.4(DIN)
$3N6353: U58.2(DOUT) U59.4(DIN)
$3N6357: U59.2(DOUT) U60.4(DIN)
$3N6359: U60.2(DOUT) U61.4(DIN)
$3N6363: U61.2(DOUT) U62.4(DIN)
$3N6365: U62.2(DOUT) U63.4(DIN)
$3N6369: U63.2(DOUT) U64.4(DIN)
$3N6371: U64.2(DOUT) U65.4(DIN)
$3N6375: U65.2(DOUT) U66.4(DIN)
$3N6377: U66.2(DOUT) U67.4(DIN)
$3N6383: U69.2(DOUT) U70.4(DIN)
$3N6385: U70.2(DOUT) U71.4(DIN)
$3N6389: U71.2(DOUT) U72.4(DIN)
$3N6391: U72.2(DOUT) U73.4(DIN)
$3N6395: U73.2(DOUT) U74.4(DIN)
$3N6397: U74.2(DOUT) U75.4(DIN)
$3N6401: U75.2(DOUT) U76.4(DIN)
$3N6403: U76.2(DOUT) U77.4(DIN)
$3N6407: U77.2(DOUT) U78.4(DIN)
$3N6409: U78.2(DOUT) U79.4(DIN)
$3N6413: U79.2(DOUT) U80.4(DIN)
$3N6415: U80.2(DOUT) U81.4(DIN)
$3N6419: U81.2(DOUT) U82.4(DIN)
$3N6421: U82.2(DOUT) U83.4(DIN)
$3N6528: U67.2(DOUT) U68.4(DIN)
$3N6530: U68.2(DOUT) U69.4(DIN)

Not connected (* = marked no-connect by the designer): FPC2 9* 10*; U1 7(Q7#); U2 7(Q7#); U3 7(Q7#); U4 7(Q7#); U5 7(Q7#); U6 7(Q7#); U7 7(Q7#); U8 7(Q7#); U10 7(Q7#) 10(DS); U13 2(PC13-TAMPER-RTC) 3(PC14-OSC32_IN) 4(PC15-OSC32_OUT) 10(PA0_WKUPUSART2_CTSADC12_IN0TIM2_CH1_ETR) 11(PA1USART2_RTSADC12_IN1TIM2_CH2) 12(PA2USART2_TXADC12_IN2TIM2_CH3) 13(PA3USART2_RXADC12_IN3TIM2_CH4) 14(PA4SPI1_NSSUSART2_CKADC12_IN4) 17(PA7SPI1_MOSIADC12_IN7TIM3_CH2) 19(PB1ADC12_IN9TIM3_CH4) 20(PB2BOOT1) 21(PB10I2C2_SCLUSART3_TX) 22(PB11I2C2_SDAUSART3_RX-) 25(PB12SPI2_NSSI2C2_SMBAUSART3_CKTIM1_BKIN) 27(PB14SPI2_MISOUSART3_RTSTIM1_CH2N) 29(PA8USART1_CKTIM1_CH1MCO) 38(PA15JTDI) 41(PB5I2C1_SMBA) 42(PB6I2C1_SCLTIM4_CH1) 43(PB7I2C1_SDATIM4_CH2) 45(PB8TIM4_CH3) 46(PB9TIM4_CH4); U14 4(NC); U83 2(DOUT)

## Notes on the sheets
sheet 2
- MCU
- CONN
- POWER
